# EAGLE design F4_mini (EAGLE 7.2.0)
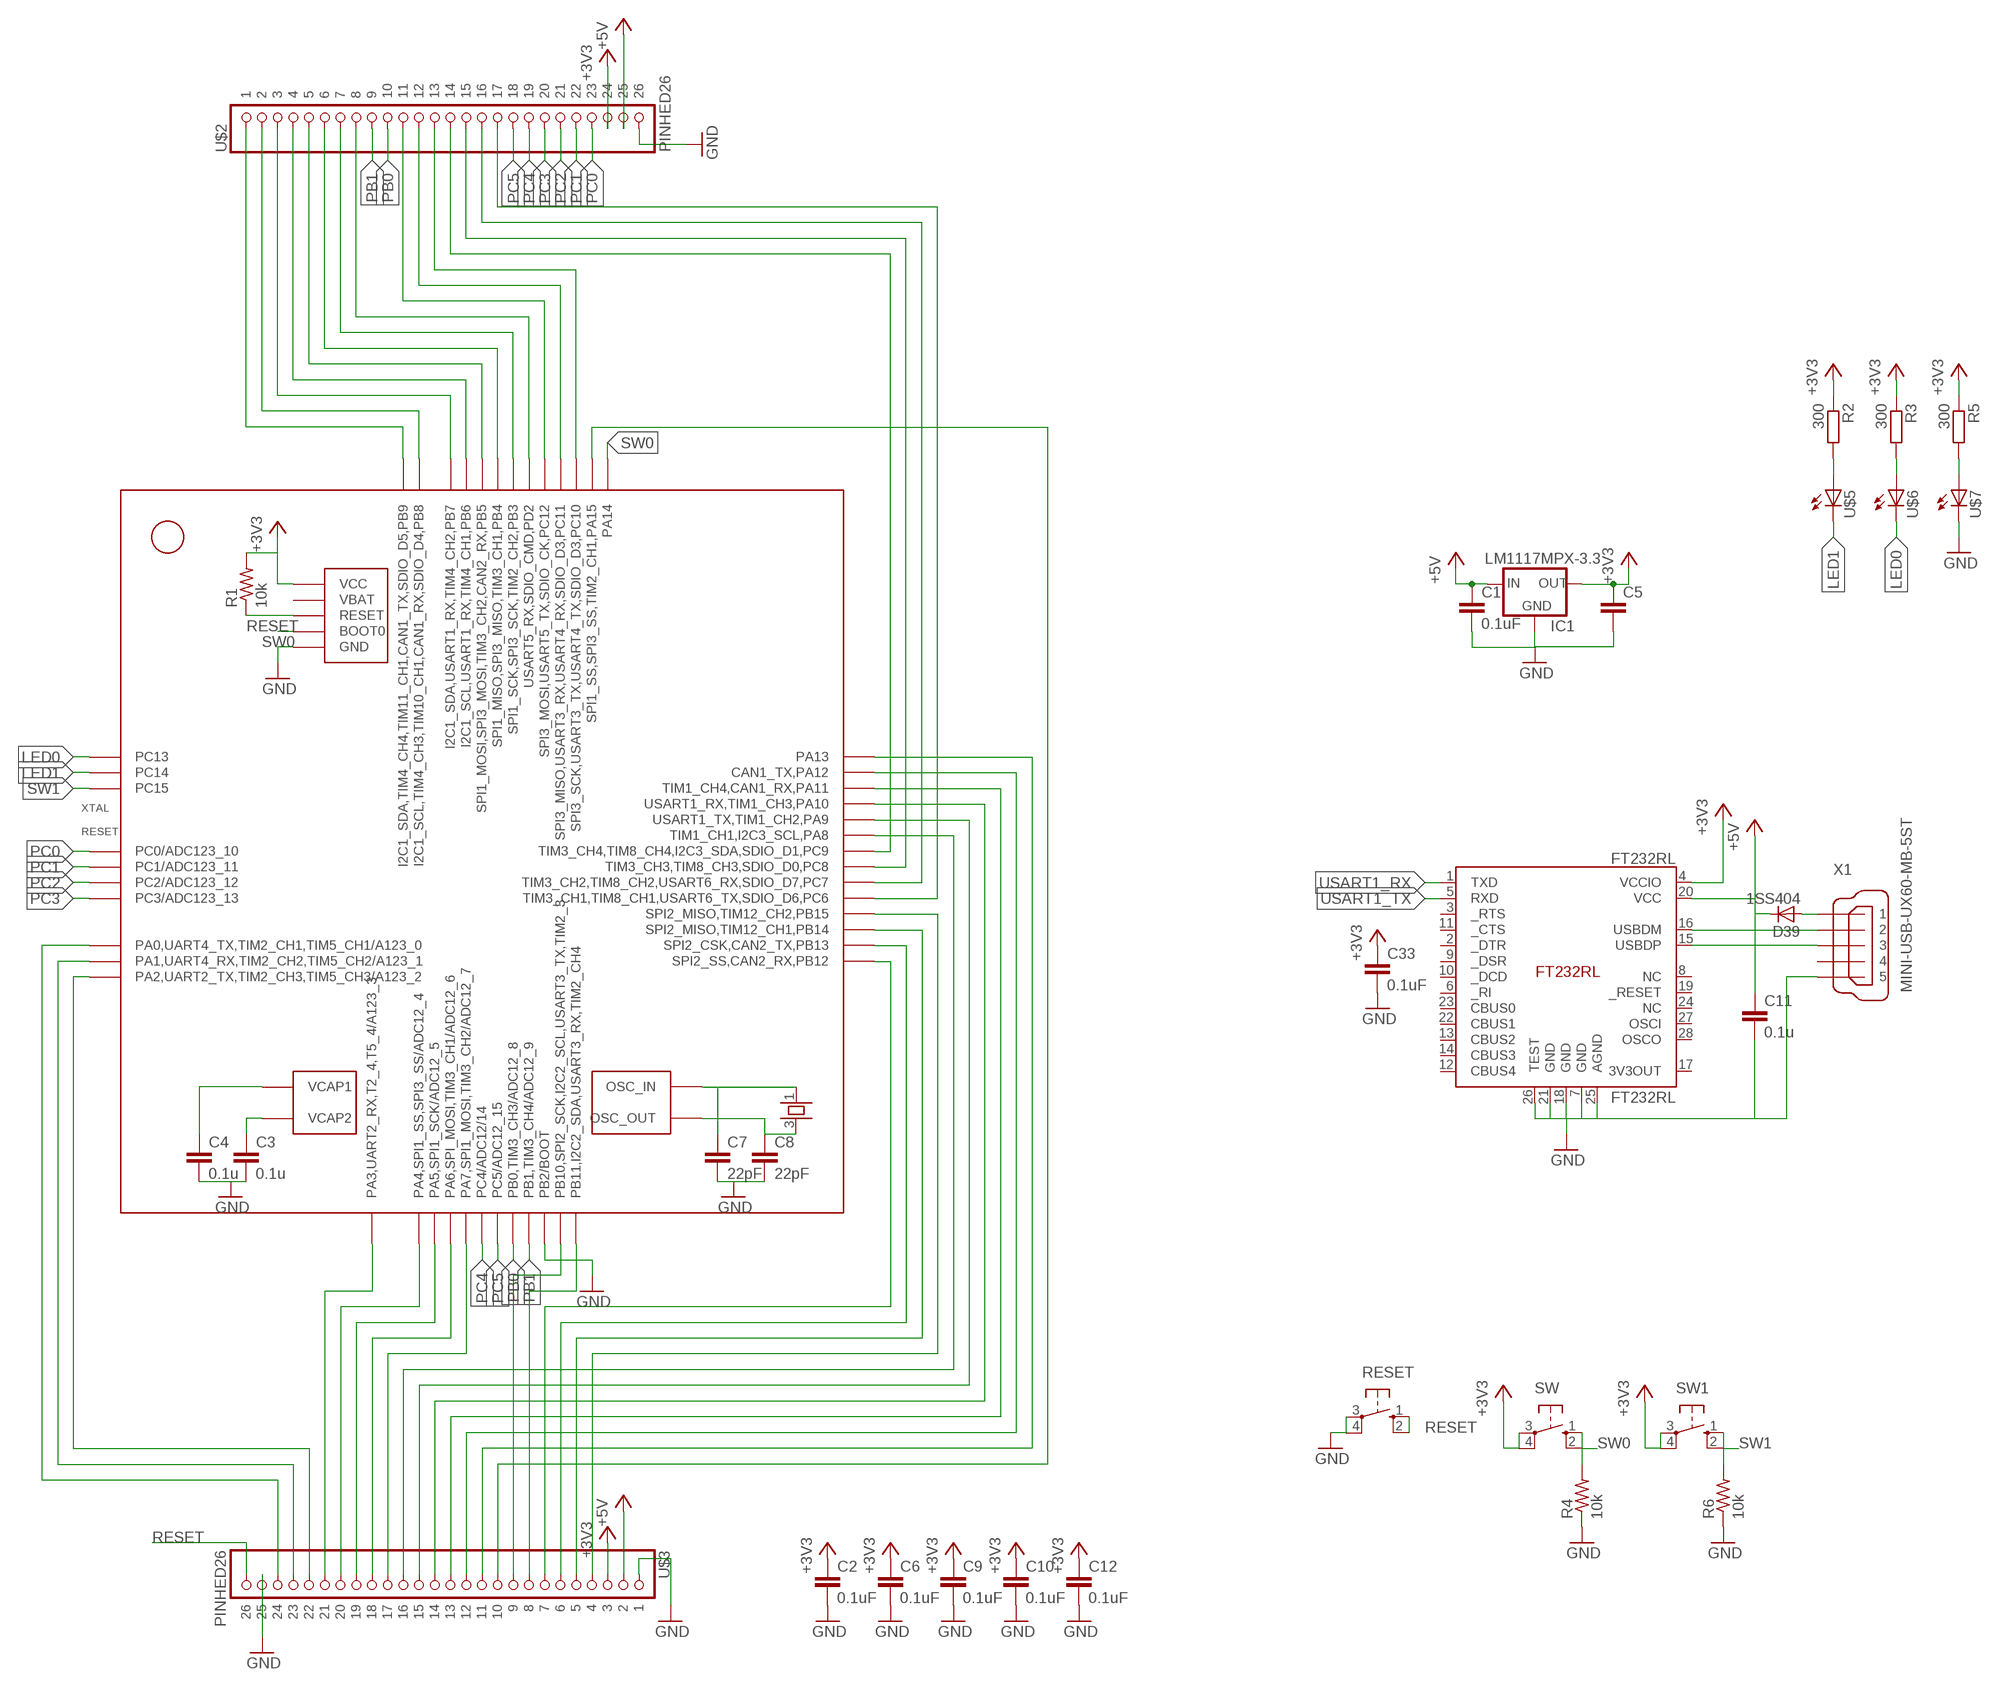
[diagram p0: schematic, sheet 1]

## Parts
C1  0.1uF  C-EUC0603K  [C0603K]
C2  0.1uF  C-EUC0603  [C0603]
C3  0.1u  C-EUC0603K  [C0603K]
C4  0.1u  C-EUC0603K  [C0603K]
C5  C-EUC0603K  [C0603K]
C6  0.1uF  C-EUC0603  [C0603]
C7  22pF  C-EUC0603K  [C0603K]
C8  22pF  C-EUC0603K  [C0603K]
C9  0.1uF  C-EUC0603  [C0603]
C10  0.1uF  C-EUC0603  [C0603]
C11  0.1u  C-EUC0603K  [C0603K]
C12  0.1uF  C-EUC0603  [C0603]
C33  0.1uF  C-EUC0603  [C0603]
D39  1SS404  [USC(1.25X2.5)]
FT232RL  FT232RL  [SSOP-28]
IC1  LM1117MPX-3.3  LM1117  [SOT223]
R1  10k  R-US_R0603  [R0603]
R2  300  R-EU_R0603  [R0603]
R3  300  R-EU_R0603  [R0603]
R4  10k  R-US_R0603  [R0603]
R5  300  R-EU_R0603  [R0603]
R6  10k  R-US_R0603  [R0603]
RESET  10-XX  [B3F-10XX]
SW  10-XX  [B3F-10XX]
SW1  10-XX  [B3F-10XX]
U$1  STM32F405_T  [LQFP64]
U$2  PINHED26  [PINHED26]
U$3  PINHED26  [PINHED26]
U$4  25MHz  ASF_T  [ASF]
U$5  0603  [0603]
U$6  0603  [0603]
U$7  0603  [0603]
X1  MINI-USB-UX60-MB-5ST  [UX60-MB-5ST]

## Nets
+3V3: C2.1 C5.1 C6.1 C9.1 C10.1 C12.1 C33.1 FT232RL.4(VCCIO) IC1.2(OUT1) IC1.4(OUT) R1.2 R2.1 R3.1 R5.1 SW1.3(P) SW1.4(P1) SW.3(P) SW.4(P1) U$1.13(VCC) U$1.19(VCC) U$1.32(VCC) U$1.48(VCC) U$1.64(VCC) U$2.25 U$3.4
+5V: C1.1 C11.1 D39.K(C) FT232RL.20(VCC) IC1.3(IN) U$2.26 U$3.3
A: U$1.59(I2C1_SDA,USART1_RX,TIM4_CH2,PB7) U$2.4
GND: C1.2 C2.2 C3.2 C4.2 C5.2 C6.2 C7.2 C8.2 C9.2 C10.2 C11.2 C12.2 C33.2 FT232RL.7(GND) FT232RL.18(GND) FT232RL.21(GND) FT232RL.25(AGND) FT232RL.26(TEST) IC1.1(GND) R4.1 R6.1 RESET.3(P) RESET.4(P1) U$1.12(GND) U$1.18(GND) U$1.28(PB2/BOOT) U$1.63(GND) U$2.27 U$3.2 U$3.26 U$7.C X1.5
LED0: U$1.2(PC13) U$6.C
LED1: U$1.3(PC14) U$5.C
N$1: R2.2 U$5.A
N$2: U$1.16(PA2,UART2_TX,TIM2_CH3,TIM5_CH3/A123_2) U$3.23
N$3: U$1.14(PA0,UART4_TX,TIM2_CH1,TIM5_CH1/A123_0) U$3.25
N$4: U$1.15(PA1,UART4_RX,TIM2_CH2,TIM5_CH2/A123_1) U$3.24
N$5: U$1.41(TIM1_CH1,I2C3_SCL,PA8) U$3.17
N$6: U$1.22(PA6,SPI_MOSI,TIM3_CH1/ADC12_6) U$3.19
N$7: U$1.21(PA5,SPI1_SCK/ADC12_5) U$3.20
N$8: U$1.20(PA4,SPI1_SS,SPI3_SS/ADC12_4) U$3.21
N$9: U$1.17(PA3,UART2_RX,T2_4,T5_4/A123_3) U$3.22
N$10: D39.A X1.1
N$11: R3.2 U$6.A
N$12: R5.2 U$7.A
N$13: U$1.44(TIM1_CH4,CAN1_RX,PA11) U$3.14
N$14: U$1.45(CAN1_TX,PA12) U$3.13
N$15: U$1.46(PA13) U$3.12
N$17: U$1.23(PA7,SPI1_MOSI,TIM3_CH2/ADC12_7) U$3.18
N$18: U$1.61(I2C1_SCL,TIM4_CH3,TIM10_CH1,CAN1_RX,SDIO_D4,PB8) U$2.3
N$19: U$1.62(I2C1_SDA,TIM4_CH4,TIM11_CH1,CAN1_TX,SDIO_D5,PB9) U$2.2
N$20: U$1.34(SPI2_CSK,CAN2_TX,PB13) U$3.7
N$21: U$1.33(SPI2_SS,CAN2_RX,PB12) U$3.8
N$22: U$1.30(PB11,I2C2_SDA,USART3_RX,TIM2_CH4) U$3.9
N$23: U$1.29(PB10,SPI2_SCK,I2C2_SCL,USART3_TX,TIM2_3) U$3.10
N$24: U$1.50(SPI1_SS,SPI3_SS,TIM2_CH1,PA15) U$3.11
N$27: U$1.58(I2C1_SCL,USART1_RX,TIM4_CH1,PB6) U$2.5
N$28: U$1.57(SPI1_MOSI,SPI3_MOSI,TIM3_CH2,CAN2_RX,PB5) U$2.6
N$30: U$1.56(SPI1_MISO,SPI3_MISO,TIM3_CH1,PB4) U$2.7
N$31: U$1.55(SPI1_SCK,SPI3_SCK,TIM2_CH2,PB3) U$2.8
N$32: U$1.54(USART5_RX,SDIO_CMD,PD2) U$2.9
N$38: U$1.53(SPI3_MOSI,USART5_TX,SDIO_CK,PC12) U$2.12
N$39: U$1.52(SPI3_MISO,USART3_RX,USART4_RX,SDIO_D3,PC11) U$2.13
N$40: U$1.51(SPI3_SCK,USART3_TX,USART4_TX,SDIO_D3,PC10) U$2.14
N$41: C3.1 U$1.47(VCAP2)
N$42: C4.1 U$1.31(VCAP1)
N$43: U$1.40(TIM3_CH4,TIM8_CH4,I2C3_SDA,SDIO_D1,PC9) U$2.15
N$44: C7.1 U$1.5(OSC_IN) U$4.1
N$45: C8.1 U$1.6(OSC_OUT) U$4.3
N$46: U$1.39(TIM3_CH3,TIM8_CH3,SDIO_D0,PC8) U$2.16
N$47: U$1.38(TIM3_CH2,TIM8_CH2,USART6_RX,SDIO_D7,PC7) U$2.17
N$48: FT232RL.16(USBDM) X1.2
N$49: FT232RL.15(USBDP) X1.3
N$50: U$1.37(TIM3_CH1,TIM8_CH1,USART6_TX,SDIO_D6,PC6) U$2.18
PB0: U$1.26(PB0,TIM3_CH3/ADC12_8) U$2.11
PB1: U$1.27(PB1,TIM3_CH4/ADC12_9) U$2.10
PB14: U$1.35(SPI2_MISO,TIM12_CH1,PB14) U$3.6
PB15: U$1.36(SPI2_MISO,TIM12_CH2,PB15) U$3.5
PC0: U$1.8(PC0/ADC123_10) U$2.24
PC1: U$1.9(PC1/ADC123_11) U$2.23
PC2: U$1.10(PC2/ADC123_12) U$2.22
PC3: U$1.11(PC3/ADC123_13) U$2.21
PC4: U$1.24(PC4/ADC12/14) U$2.20
PC5: U$1.25(PC5/ADC12_15) U$2.19
RESET: R1.1 RESET.1(S) RESET.2(S1) U$1.7(RESET) U$3.27
SW0: R4.2 SW.1(S) SW.2(S1) U$1.49(PA14) U$1.60(BOOT0)
SW1: R6.2 SW1.1(S) SW1.2(S1) U$1.4(PC15)
USART1_RX: FT232RL.1(TXD) U$1.43(USART1_RX,TIM1_CH3,PA10) U$3.15
USART1_TX: FT232RL.5(RXD) U$1.42(USART1_TX,TIM1_CH2,PA9) U$3.16
Unconnected: FT232RL.2(_DTR) FT232RL.3(_RTS) FT232RL.6(_RI) FT232RL.8(NC) FT232RL.9(_DSR) FT232RL.10(_DCD) FT232RL.11(_CTS) FT232RL.12(CBUS4) FT232RL.13(CBUS2) FT232RL.14(CBUS3) FT232RL.17(3V3OUT) FT232RL.19(_RESET) FT232RL.22(CBUS1) FT232RL.23(CBUS0) FT232RL.24(NC) FT232RL.27(OSCI) FT232RL.28(OSCO) U$1.1(VBAT) X1.4

## Library data of the parts
C1-C12 C33 = resistor:C-EU: CAPACITOR, European symbol
D39 = Diode:1SS404
FT232RL = ftdi:FT232RL
IC1 = VoltageRegulator:LM1117
R1 R4 R6 = resistor:R-US_: RESISTOR, American symbol
R2 R3 R5 = resistor:R-EU_: RESISTOR, European symbol
RESET SW SW1 = switch-omron:10-XX: OMRON SWITCH; MPN: B3F-1000; OC_FARNELL: 176432; OC_NEWARK: 36M3542
U$1 = stm32f:STM32F405_T
U$2 U$3 = pinhead:PINHED26
U$4 = crystal:ASF_T
U$5-U$7 = led_0603:0603
X1 = con-hirose:MINI-USB-: MINI USB Connector Source: http://www.hirose.co.jp/cataloge_hp/e24000019.pdf; OC_FARNELL: unknown; OC_NEWARK: unknown

## Board
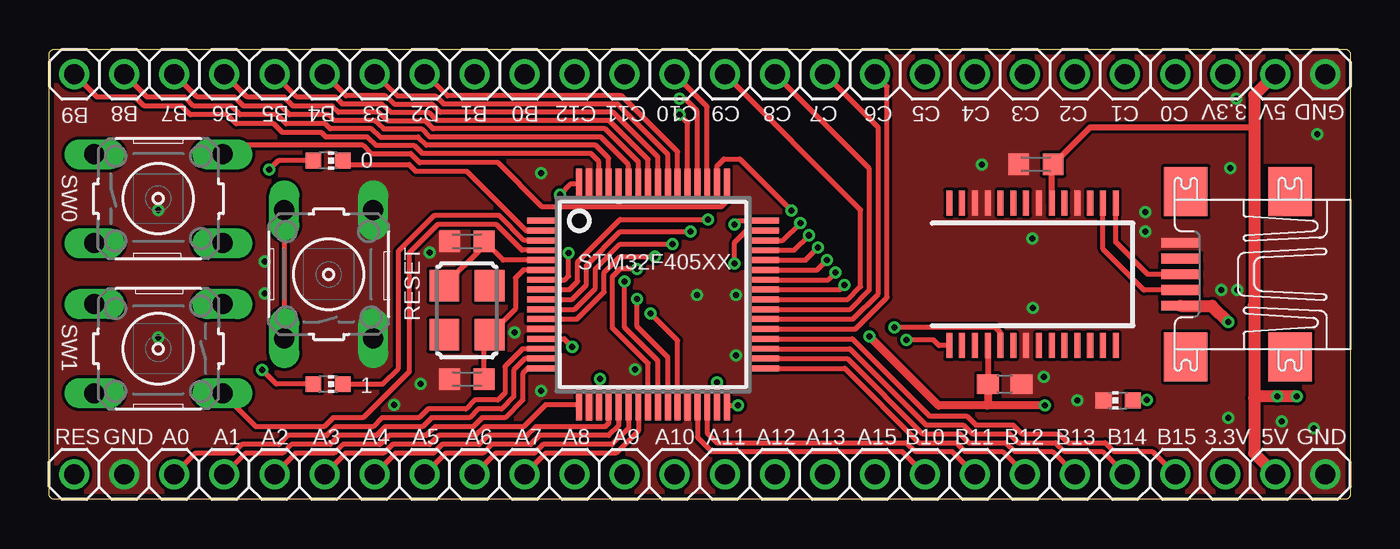
[diagram p1: board, top side]
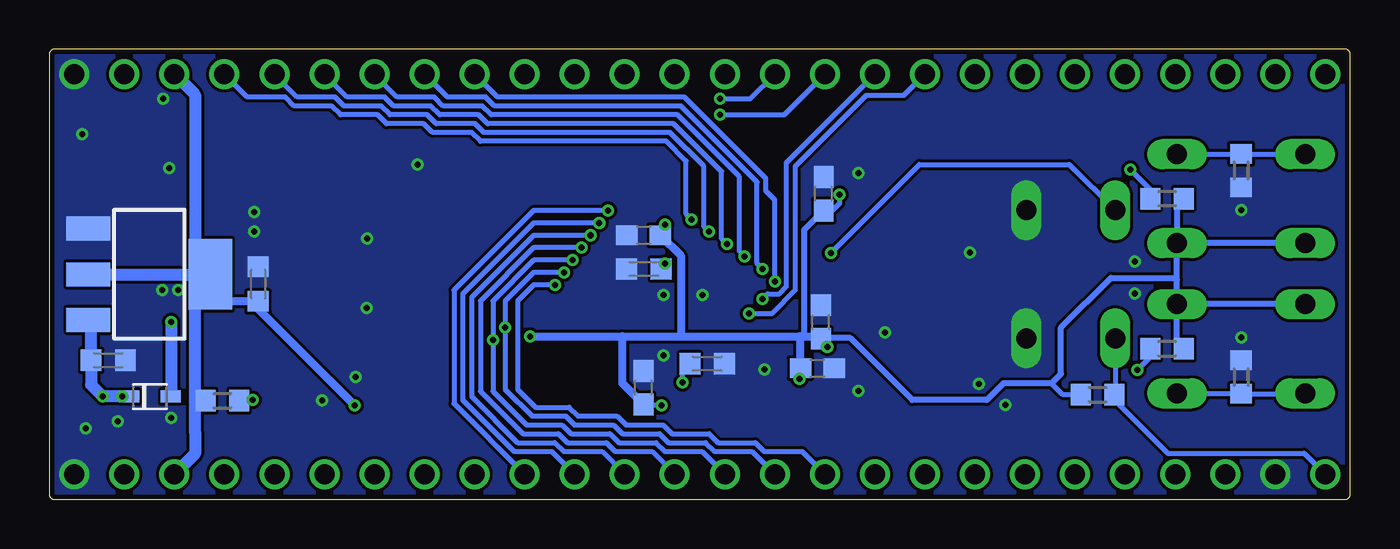
[diagram p2: board, bottom side, seen from below]

Size 66.04 x 22.86 mm. Coordinates in mm from the lower left corner, seen from the top.
Outline: 0,22.61 arc-90 0.25,22.86 65.79,22.86 arc-90 66.04,22.61 66.04,0.25 arc-90 65.79,0 0.25,0 arc-90 0,0.25 0,22.61
Copper layers (1*16): Top 0.035mm / dielectric 1.5mm / Bottom 0.035mm
Design rules "hoge": minimum track width 6mil, minimum drill 12mil, track to track 6mil, track to pad 6mil, pad to pad 6mil, via to via 6mil, smd to smd 0mil, copper to edge 10mil, drill to drill 10mil, minimum pad ring 10mil, minimum via ring 6mil, stop-mask expansion 2mil, vias tented up to drill 100mil, thermal gap 10mil

### Footprints (pad centres in the part's own frame; a part is rotated, then mirrored left to right if it is on the bottom)
C0603K = smd 1.05 x 1.08: 1 -0.875,0; 2 0.875,0
C0603 = smd 1.1 x 1: 1 -0.85,0; 2 0.85,0
USC(1.25X2.5) = smd 1 x 0.6: A -1.05,0; K 1.05,0
SSOP-28 = smd 0.305 x 1.27: 1 -4.225,-3.625; 2 -3.575,-3.625; 3 -2.925,-3.625; 4 -2.275,-3.625; 5 -1.625,-3.625; 6 -0.975,-3.625; 7 -0.325,-3.625; 8 0.325,-3.625; 9 0.975,-3.625; 10 1.625,-3.625; 11 2.275,-3.625; 12 2.925,-3.625; 13 3.575,-3.625; 14 4.225,-3.625; 15 4.225,3.625; 16 3.575,3.625; 17 2.925,3.625; 18 2.275,3.625; 19 1.625,3.625; 20 0.975,3.625; 21 0.325,3.625; 22 -0.325,3.625; 23 -0.975,3.625; 24 -1.625,3.625; 25 -2.275,3.625; 26 -2.925,3.625; 27 -3.575,3.625; 28 -4.225,3.625
SOT223 = smd 1.219 x 2.235: 1 -2.311,-3.099; 2 0,-3.099; 3 2.311,-3.099 | smd 3.6 x 2.2: 4 0,3.099
R0603 = smd 1 x 1.1: 1 -0.85,0; 2 0.85,0
B3F-10XX = drill 1.016 long: 1 -3.251,2.261; 2 3.251,2.261; 3 -3.251,-2.261; 4 3.251,-2.261
LQFP64 = smd 1.6 x 0.3: 1 -5.6,3.75; 2 -5.6,3.25; 3 -5.6,2.75; 4 -5.6,2.25; 5 -5.6,1.75; 6 -5.6,1.25; 7 -5.6,0.75; 8 -5.6,0.25; 9 -5.6,-0.25; 10 -5.6,-0.75; 11 -5.6,-1.25; 12 -5.6,-1.75; 13 -5.6,-2.25; 14 -5.6,-2.75; 15 -5.6,-3.25; 16 -5.6,-3.75; 33 5.6,-3.75; 34 5.6,-3.25; 35 5.6,-2.75; 36 5.6,-2.25; 37 5.6,-1.75; 38 5.6,-1.25; 39 5.6,-0.75; 40 5.6,-0.25; 41 5.6,0.25; 42 5.6,0.75; 43 5.6,1.25; 44 5.6,1.75; 45 5.6,2.25; 46 5.6,2.75; 47 5.6,3.25; 48 5.6,3.75 | smd 0.3 x 1.6: 17 -3.75,-5.6; 18 -3.25,-5.6; 19 -2.75,-5.6; 20 -2.25,-5.6; 21 -1.75,-5.6; 22 -1.25,-5.6; 23 -0.75,-5.6; 24 -0.25,-5.6; 25 0.25,-5.6; 26 0.75,-5.6; 27 1.25,-5.6; 28 1.75,-5.6; 29 2.25,-5.6; 30 2.75,-5.6; 31 3.25,-5.6; 32 3.75,-5.6; 49 3.75,5.6; 50 3.25,5.6; 51 2.75,5.6; 52 2.25,5.6; 53 1.75,5.6; 54 1.25,5.6; 55 0.75,5.6; 56 0.25,5.6; 57 -0.25,5.6; 58 -0.75,5.6; 59 -1.25,5.6; 60 -1.75,5.6; 61 -2.25,5.6; 62 -2.75,5.6; 63 -3.25,5.6; 64 -3.75,5.6
PINHED26 = drill 1.016: 2 -29.21,0; 3 -26.67,0; 4 -24.13,0; 5 -21.59,0; 6 -19.05,0; 7 -16.51,0; 8 -13.97,0; 9 -11.43,0; 10 -8.89,0; 11 -6.35,0; 12 -3.81,0; 13 -1.27,0; 14 1.27,0; 15 3.81,0; 16 6.35,0; 17 8.89,0; 18 11.43,0; 19 13.97,0; 20 16.51,0; 21 19.05,0; 22 21.59,0; 23 24.13,0; 24 26.67,0; 25 29.21,0; 26 31.75,0; 27 34.29,0
ASF = smd 1.6 x 1.5: 1 -1.25,-1.15; 2 1.25,-1.15; 3 1.25,1.15; 4 -1.25,1.15
0603 = smd 0.8 x 0.8: A 0,-0.75; C 0,0.75
UX60-MB-5ST = smd 2 x 0.5: 1 2.25,1.6; 2 2.25,0.8; 3 2.25,0; 4 2.25,-0.8; 5 2.25,-1.6 | smd 2.2 x 2.5: M1 -3.3,-4.2; M2 -3.3,4.2; M3 2,4.2; M4 2,-4.2

### Placement (x,y rotation side)
C1  63.04,7.06 0 bottom
C2  26.87,9 90 bottom
C3  35.86,11.7 180 bottom
C4  32.64,6.89 0 bottom
C5  55.44,10.93 90 bottom
C6  26.73,15.52 90 bottom
C7  21.2,13.1 180 top
C8  21.2,6.1 180 top
C9  27.05,6.66 0 bottom
C10  35.87,5.67 90 bottom
C11  50.08,17.01 180 top
C12  35.87,13.41 180 bottom
C33  48.5,5.85 0 top
D39  60.93,5.22 180 bottom
FT232RL  49.91,11.43 0 top
IC1  60.96,11.43 270 bottom
R1  12.82,5.31 180 bottom
R2  9.3,7.65 180 bottom
R3  9.3,15.27 180 bottom
R4  5.54,16.7 90 bottom
R5  57.25,5.01 0 bottom
R6  5.54,6.21 270 bottom
RESET  14.19,11.43 90 top
SW  5.54,15.27 0 top
SW1  5.54,7.65 180 top
U$1  30.65,10.4 0 top
U$2  30.48,21.59 0 top
U$3  35.56,1.27 180 top
U$4  21.2,9.6 270 top
U$5  14.16,5.85 270 top
U$6  14.16,17.2 270 top
U$7  54.26,5.03 90 top
X1  59.69,11.43 180 top

### Tracks (layer width: path | path; a pad name or v marks a point on that pad's centre or on a via)
+3V3  (via drill 0.3)
  Top 0.254: v34.79,13.95 34.99,14.15 U$1.48 | U$1.32 34.43,4.77 v34.97,4.77 | U$1.19 27.9,6.07 v27.95,6.12 | U$1.64 26.44,16 v25.92,15.48 | U$1.13 26.14,8.15 v26.55,7.74
  Top 0.305: FT232RL.4 47.63,5.87 C33.1
  Top 0.406: 47.63,5.87 47.63,4.79 47.61,4.77 | v50.54,4.77 47.61,4.77 | 47.61,4.77 45.14,4.77 v41.63,8.28
  Bottom 0.254: 58.58,3.48 58.64,3.42 | v34.79,13.95 34.79,13.64 C12.1 | v34.97,4.77 35.82,4.77 C10.1 | v27.95,6.12 27.95,6.61 C9.1 | R1.2 14.58,5.31 15.16,5.89 | v25.92,15.48 25.92,15.03 26.28,14.67 C6.1 | R5.1 58.58,5.01 58.64,4.95 | 27,8.28 C2.1 26.55,7.83 v26.55,7.74
  Bottom 0.305: SW.3 SW.4 | SW1.4 SW1.3 | R3.1 8.79,14.93 SW.4 | R2.1 8.79,7.99 SW1.3 | SW1.3 8.79,11.16 | 8.79,11.16 SW.4 | 8.79,11.16 8.88,11.25 12.15,11.25 14.68,8.72 14.68,6.38 15.16,5.89 17.59,5.89 18.45,5.04 22.23,5.04 25.38,8.19 26.83,8.19 C2.1 | C6.1 27.72,13.68 27.72,8.28
  Bottom 0.406: IC1.4 57.47,11.04 57.47,10.44 57.09,10.05 C5.1 55.44,9.67 v50.54,4.77 | v41.63,8.28 36.95,8.28 | 36.95,8.28 33.98,8.28 | 33.98,8.28 27.95,8.28 | 27.95,8.28 27.72,8.28 27,8.28 | C12.1 33.98,12.37 33.98,8.28 | C9.1 27.9,8.23 27.95,8.28 | C10.1 36.95,5.9 36.95,8.28
  Bottom 0.61: IC1.2 58.64,11.43 | 58.64,11.43 IC1.4 | 58.64,11.43 58.64,20.54 U$2.25 | 58.64,11.43 58.64,4.95 58.64,3.42 58.64,2.32 U$3.4
+5V  (via drill 0.3)
  Top 0.305: 61.16,18.9 52.84,18.9 C11.1 50.88,16.94 FT232RL.20
  Top 0.61: 61.16,9.81 61.16,18.9 61.16,20.52 U$2.26 | 61.16,9.81 61.16,5.13 | 61.16,5.13 61.16,2.34 U$3.3 | 61.14,9.83 61.16,9.81 | v63.32,5.22 61.25,5.22 61.16,5.13
  Bottom 0.61: IC1.3 63.91,8.97 C1.1 63.91,5.82 v63.32,5.22 v62.33,5.22 D39.K
A
  Top 0.254: U$2.4 7.51,20.43 9.41,20.43 9.86,19.98 11.75,19.98 12.2,19.53 14.18,19.53 14.47,19.24 16.52,19.24 16.97,18.82 18.89,18.82 19.31,18.4 28,18.4 29.4,17 U$1.59
GND  (via drill 0.3)
  other vias: 55.63,14.58 55.63,13.59 47.35,17.01 60.25,20.35 59.95,16.83 62.56,3.96 59.86,4.14 49.93,9.71 60.31,10.62 64.36,18.54 64.18,3.6 49.9,13.25 59.5,10.62 50.5,6.21 52.18,5.03 34.87,10.37 32.89,10.37 34.87,7.31 29.74,6.59 24.97,5.51 17.5,4.79 18.85,5.87 19.3,12.53 10.93,12.08 10.93,10.46 5.53,14.69 5.53,8.21 24.97,16.58 23.62,8.48
  pour Top (rank 6, no thermals): -4,26.86 70.04,26.86 70.04,-4 -4,-4
  pour Bottom (rank 6, no thermals): -2,24.86 68.04,24.86 68.04,-2 -2,-2
LED0
  Top 0.254: U$6.C 15.1,17.01 18.27,17.01 18.63,16.65 21.2,16.65 24.2,13.65 U$1.2
LED1
  Top 0.254: U$1.3 24.11,13.15 22.86,14.4 19.53,14.4 17.73,12.6 17.73,6.66 16.92,5.85 U$5.C
N$1  (via drill 0.3)
  Top 0.254: U$5.A 11.52,5.85 v10.8,6.57
  Bottom 0.254: v10.8,6.57 10.15,7.22 R2.2
N$2
  Top 0.254: U$3.23 12.5,2.34 14.45,2.34 14.9,2.79 16.79,2.79 17.24,3.24 19.13,3.24 19.58,3.69 21.51,3.69 21.96,4.14 23.13,4.14 24.03,5.04 24.03,6.39 24.29,6.65 U$1.16
N$3
  Top 0.254: U$3.25 7.42,2.34 9.32,2.34 9.77,2.79 11.66,2.79 12.11,3.24 14.09,3.24 14.54,3.69 16.43,3.69 16.88,4.14 18.77,4.14 19.22,4.59 21.15,4.59 21.6,5.04 22.77,5.04 23.13,5.4 23.13,6.75 24.03,7.65 U$1.14
N$4
  Top 0.254: U$3.24 9.96,2.34 11.84,2.34 12.29,2.79 14.27,2.79 14.72,3.24 16.61,3.24 17.06,3.69 18.95,3.69 19.4,4.14 21.33,4.14 21.78,4.59 22.95,4.59 23.58,5.22 23.58,6.57 24.16,7.15 U$1.15
N$5  (via drill 0.3)
  Top 0.254: U$1.41 40.13,10.65 v40.37,10.89
  Bottom 0.254: v40.37,10.89 41.45,10.89 42.26,10.08 42.26,5.58 41.36,4.68 39.65,4.68 39.2,4.23 37.22,4.23 36.77,3.78 34.88,3.78 34.43,3.33 32.54,3.33 32.09,2.88 30.2,2.88 29.75,2.43 27.83,2.43 U$3.17
N$6
  Top 0.254: U$1.22 29.4,3.61 28.58,2.79 25.07,2.79 24.62,2.34 22.66,2.34 U$3.19
N$7
  Top 0.254: U$1.21 28.9,3.74 28.4,3.24 24.89,3.24 24.44,2.79 22.46,2.79 22.01,2.34 20.12,2.34 U$3.20
N$8
  Top 0.254: U$1.20 28.4,3.87 28.22,3.69 24.71,3.69 24.26,3.24 22.28,3.24 21.83,2.79 19.94,2.79 19.49,2.34 17.58,2.34 U$3.21
N$9
  Top 0.254: U$1.17 25.19,4.8 24.08,3.69 22.1,3.69 21.65,3.24 19.76,3.24 19.31,2.79 17.42,2.79 16.97,2.34 15.04,2.34 U$3.22
N$10  (via drill 0.3)
  Top 0.61: X1.1 59.02,9.83 v59.85,9
  Bottom 0.61: v59.85,9 59.85,5.25 D39.A
N$11  (via drill 0.3)
  Top 0.254: U$6.A 11.62,17.2 v11.16,16.74
  Bottom 0.254: v11.16,16.74 10.15,15.73 R3.2
N$12  (via drill 0.3)
  Top 0.254: v55.71,5.04 U$7.A
  Bottom 0.254: R5.2 56.37,5.04 v55.71,5.04
N$13  (via drill 0.3)
  Top 0.254: U$1.44 38.39,12.15 v39.02,12.78
  Bottom 0.254: v39.02,12.78 41.45,12.78 44.15,10.08 44.15,5.49 41.99,3.33 40.19,3.33 39.74,2.88 37.76,2.88 37.31,2.43 35.45,2.43 U$3.14
N$14  (via drill 0.3)
  Top 0.254: U$1.45 37.81,12.65 v38.57,13.41
  Bottom 0.254: U$3.13 37.99,2.43 39.92,2.43 40.37,2.88 42.26,2.88 44.6,5.22 44.6,10.26 41.45,13.41 v38.57,13.41
N$15  (via drill 0.3)
  Top 0.254: U$1.46 37.23,13.15 v38.12,14.04
  Bottom 0.254: v38.12,14.04 41.45,14.04 45.05,10.44 45.05,5.04 42.44,2.43 40.53,2.43 U$3.12
N$17
  Top 0.254: U$1.23 29.9,3.48 28.76,2.34 25.2,2.34 U$3.18
N$18
  Top 0.254: U$1.61 28.4,17.32 27.74,17.98 19.15,17.98 18.73,18.4 16.79,18.4 16.34,18.82 14.26,18.82 14,19.08 12.02,19.08 11.57,19.53 9.68,19.53 9.23,19.98 7.34,19.98 6.89,20.43 4.97,20.43 U$2.3
N$19
  Top 0.254: U$1.62 27.9,17.15 27.49,17.56 18.94,17.56 18.52,17.98 16.58,17.98 16.16,18.4 14.05,18.4 13.82,18.63 11.84,18.63 11.39,19.08 9.5,19.08 9.05,19.53 7.16,19.53 6.71,19.98 4.82,19.98 4.37,20.43 2.43,20.43 U$2.2
N$20
  Top 0.254: U$3.7 50.91,2.43 49.01,2.43 48.56,2.88 46.67,2.88 46.22,3.33 44.33,3.33 40.51,7.15 U$1.34
N$21
  Top 0.254: U$1.33 40.38,6.65 44.15,2.88 46.04,2.88 46.49,2.43 48.37,2.43 U$3.8
N$22
  Top 0.254: U$1.30 33.4,3.37 33.89,2.88 43.52,2.88 43.97,2.43 45.83,2.43 U$3.9
N$23
  Top 0.254: U$1.29 32.9,3.15 33.62,2.43 43.29,2.43 U$3.10
N$24  (via drill 0.3)
  Top 0.254: U$1.50 33.9,16.93 34.25,17.28 35.06,17.28 v37.67,14.67
  Bottom 0.254: v37.67,14.67 41.45,14.67 45.5,10.62 45.5,4.86 U$3.11
N$27
  Top 0.254: U$2.5 10.05,20.43 11.93,20.43 12.38,19.98 14.36,19.98 14.68,19.66 16.7,19.66 17.15,19.24 19.07,19.24 19.49,18.82 28.21,18.82 29.9,17.13 U$1.58
N$28
  Top 0.254: U$2.6 12.59,20.43 14.54,20.43 14.89,20.08 16.88,20.08 17.33,19.66 19.25,19.66 19.67,19.24 28.42,19.24 30.4,17.26 U$1.57
N$30
  Top 0.254: U$1.56 30.9,17.39 28.63,19.66 19.85,19.66 19.43,20.08 17.51,20.08 17.06,20.5 15.06,20.5 U$2.7
N$31
  Top 0.254: U$2.8 17.67,20.5 19.61,20.5 20.03,20.08 28.84,20.08 31.4,17.52 U$1.55
N$32
  Top 0.254: U$2.9 20.21,20.5 29.05,20.5 31.9,17.65 U$1.54
N$38  (via drill 0.3)
  Top 0.254: U$1.53 32.4,19.13 v32,19.53
  Bottom 0.254: v32,19.53 28.73,19.53 U$2.12
N$39  (via drill 0.3)
  Top 0.254: U$1.52 32.9,19.71 32.27,20.34 v32,20.34
  Bottom 0.254: v32,20.34 30.46,20.34 U$2.13
N$40
  Top 0.254: U$1.51 33.4,19.94 U$2.14
N$41  (via drill 0.3)
  Top 0.254: v34.79,11.97 34.79,13.05 35.39,13.65 U$1.47
  Bottom 0.254: C3.1 34.79,11.89 v34.79,11.97
N$42  (via drill 0.3)
  Top 0.254: U$1.31 v33.9,5.93 v33.89,5.94
  Bottom 0.254: v33.89,5.94 33.89,6.51 C4.1
N$43
  Top 0.254: U$1.40 40.53,10.15 41.18,10.8 41.18,14.7 U$2.15
N$44
  Top 0.254: U$1.5 23.02,12.15 C7.1 22.07,12.88 U$4.1
N$45
  Top 0.254: C8.1 22.07,8.07 U$4.3 23.67,9.67 23.67,11.25 24.07,11.65 U$1.6
N$46
  Top 0.254: U$1.39 40.66,9.65 41.63,10.62 41.63,16.79 U$2.16
N$47
  Top 0.254: U$1.38 40.79,9.15 42.08,10.44 42.08,18.88 U$2.17
N$48
  Top 0.254: X1.2 55.57,10.63 53.48,12.71 FT232RL.16
N$49
  Top 0.254: X1.3 55.76,11.43 54.13,13.05 FT232RL.15
N$50
  Top 0.254: U$1.37 40.92,8.65 42.53,10.26 42.53,20.97 U$2.18
PB0  (via drill 0.3)
  Top 0.254: U$1.26 31.4,7.21 29.84,8.77 v29.84,10.17
  Bottom 0.254: v29.84,10.17 29.57,10.44 28.98,10.44 28.62,10.8 28.62,17.1 U$2.11
PB1  (via drill 0.3)
  Top 0.254: U$1.27 31.9,8.06 v30.51,9.45
  Bottom 0.254: v30.51,9.45 29.34,9.45 28.17,10.62 28.17,16.92 24.57,20.52 22.66,20.52 U$2.10
PB14
  Top 0.254: U$3.6 53.45,2.43 51.53,2.43 51.08,2.88 49.19,2.88 48.74,3.33 46.85,3.33 46.4,3.78 44.51,3.78 40.64,7.65 U$1.35
PB15
  Top 0.254: U$3.5 55.99,2.43 54.05,2.43 53.6,2.88 51.71,2.88 51.26,3.33 49.37,3.33 48.92,3.78 47.03,3.78 46.58,4.23 44.69,4.23 40.77,8.15 U$1.36
PC0  (via drill 0.3)
  Top 0.254: U$1.8 26.4,10.65 26.82,11.07 26.82,12.06 28.98,14.22 v33.44,14.22
  Bottom 0.254: v33.44,14.22 33.71,14.49 33.71,17.19 34.7,18.18 44.15,18.18 44.6,18.63 46.58,18.63 47.03,19.08 48.92,19.08 49.37,19.53 51.26,19.53 51.71,19.98 53.6,19.98 54.05,20.43 55.99,20.43 U$2.24
PC1  (via drill 0.3)
  Top 0.254: v32.54,13.59 28.98,13.59 27.27,11.88 27.27,10.89 26.53,10.15 U$1.9
  Bottom 0.254: v32.54,13.59 32.81,13.86 32.81,16.92 34.52,18.63 43.97,18.63 44.42,19.08 46.4,19.08 46.85,19.53 48.74,19.53 49.19,19.98 51.08,19.98 51.53,20.43 53.45,20.43 U$2.23
PC2  (via drill 0.3)
  Top 0.254: v31.64,12.96 28.98,12.96 27.72,11.7 27.72,10.71 26.66,9.65 U$1.10
  Bottom 0.254: v31.64,12.96 31.91,13.23 31.91,16.65 34.34,19.08 43.79,19.08 44.24,19.53 46.22,19.53 46.67,19.98 48.56,19.98 49.01,20.43 50.91,20.43 U$2.22
PC3  (via drill 0.3)
  Top 0.254: v30.74,12.33 28.98,12.33 28.17,11.52 28.17,10.53 26.79,9.15 U$1.11
  Bottom 0.254: v30.74,12.33 31.01,12.6 31.01,16.38 34.16,19.53 43.61,19.53 44.06,19.98 46.04,19.98 46.49,20.43 48.37,20.43 U$2.21
PC4  (via drill 0.3)
  Top 0.254: U$1.24 30.4,6.91 28.58,8.73 28.58,11.3 28.98,11.7 v29.84,11.7
  Bottom 0.254: v29.84,11.7 30.11,11.97 30.11,16.11 33.98,19.98 43.43,19.98 43.88,20.43 45.83,20.43 U$2.20
PC5  (via drill 0.3)
  Top 0.254: U$1.25 30.9,7.04 29.21,8.73 v29.21,11.07
  Bottom 0.254: v29.21,11.07 29.21,15.21 29.66,15.66 29.66,16.29 33.8,20.43 43.29,20.43 U$2.19
RESET  (via drill 0.3)
  Top 0.254: RESET.2 RESET.1 | U$1.7 26.18,11.15 26.37,11.34 v26.37,12.51
  Bottom 0.254: U$3.27 2.34,2.34 9.27,2.34 11.97,5.04 R1.1 11.93,5.35 RESET.1 | v26.37,12.51 21.87,17.01 14.26,17.01 RESET.2
SW0
  Top 0.254: U$1.49 34.4,15.14 34.11,14.85 28.89,14.85 | 28.89,14.85 25.02,14.85 22.77,17.1 18.81,17.1 18.35,17.56 16.35,17.56 15.93,17.98 9.24,17.98 SW.2 | U$1.60 28.9,14.86 28.89,14.85
  Bottom 0.254: SW.2 5.56,17.53 R4.2 5.52,17.53 SW.1
SW1
  Top 0.254: SW1.1 10.49,3.69 13.95,3.69 14.4,4.14 15.93,4.14 18.27,6.48 18.27,12.51 19.71,13.95 22.7,13.95 24,12.65 U$1.4
  Bottom 0.254: SW1.1 5.57,5.39 R6.2 2.32,5.36 SW1.2
USART1_RX  (via drill 0.3)
  Top 0.254: FT232RL.1 45.16,7.8 44.87,8.1 v43.52,8.1 | U$1.43 38.97,11.65 v39.47,12.15
  Bottom 0.254: v39.47,12.15 41.45,12.15 43.52,10.08 v43.52,8.1 43.52,5.49 41.81,3.78 40.01,3.78 39.56,3.33 37.58,3.33 37.13,2.88 35.24,2.88 34.79,2.43 32.91,2.43 U$3.15
USART1_TX  (via drill 0.3)
  Top 0.254: FT232RL.5 48.28,8.46 48.02,8.73 v42.89,8.73 | U$1.42 39.55,11.15 v39.92,11.52
  Bottom 0.254: v39.92,11.52 41.45,11.52 42.89,10.08 v42.89,8.73 42.89,5.58 41.54,4.23 39.83,4.23 39.38,3.78 37.4,3.78 36.95,3.33 35.06,3.33 34.61,2.88 32.72,2.88 32.27,2.43 30.37,2.43 U$3.16

### Text on the board
tNames: B9 | B8 | B7 | B6 | B5 | B4 | B3 | D2 | B1 | B0 | C12 | C11 | C10 | C9 | C8 | C7 | C6 | C5 | C4 | C3 | C2 | C1 | C0 | 3.3V | 5V | GND | SW0 | 0 | SW1 | RESET | 1 | RES | GND | A0 | A1 | A2 | A3 | A4 | A5 | A6 | A7 | A8 | A9 | A10 | A11 | A12 | A13 | A15 | B10 | B11 | B12 | B13 | B14 | B15 | 3.3V | 5V | GND